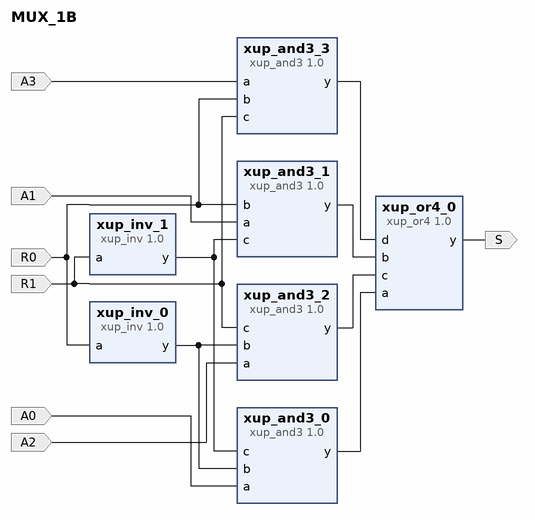
[diagram p0: block diagram of the top level]
# Vivado block design MUX_1B, xc7a100tcsg324-1, Vivado 2019.1
create_bd_design MUX_1B

create_bd_port -dir I A2
create_bd_port -dir I A3
create_bd_port -dir I R0
create_bd_port -dir I R1
create_bd_port -dir I A0
create_bd_port -dir O S
create_bd_port -dir I A1

create_bd_cell -type ip -vlnv xilinx.com:xup:xup_and3:1.0 xup_and3_0
create_bd_cell -type ip -vlnv xilinx.com:xup:xup_and3:1.0 xup_and3_1
create_bd_cell -type ip -vlnv xilinx.com:xup:xup_and3:1.0 xup_and3_2
create_bd_cell -type ip -vlnv xilinx.com:xup:xup_and3:1.0 xup_and3_3
create_bd_cell -type ip -vlnv xilinx.com:xup:xup_or4:1.0 xup_or4_0
create_bd_cell -type ip -vlnv xilinx.com:xup:xup_inv:1.0 xup_inv_0
create_bd_cell -type ip -vlnv xilinx.com:xup:xup_inv:1.0 xup_inv_1

# ---- connections ----

connect_bd_net [get_bd_pins xup_and3_0/y] [get_bd_pins xup_or4_0/a]
connect_bd_net [get_bd_pins xup_and3_1/y] [get_bd_pins xup_or4_0/b]
connect_bd_net [get_bd_pins xup_and3_2/y] [get_bd_pins xup_or4_0/c]
connect_bd_net [get_bd_pins xup_and3_3/y] [get_bd_pins xup_or4_0/d]
connect_bd_net -net DIV_1 [get_bd_ports A2] [get_bd_pins xup_and3_2/a]
connect_bd_net -net MIROIR_1 [get_bd_ports A3] [get_bd_pins xup_and3_3/a]
connect_bd_net [get_bd_pins xup_inv_0/y] [get_bd_pins xup_and3_0/b] [get_bd_pins xup_and3_2/b]
connect_bd_net -net R0_1 [get_bd_ports R0] [get_bd_pins xup_and3_1/b] [get_bd_pins xup_inv_0/a] [get_bd_pins xup_and3_3/b]
connect_bd_net [get_bd_pins xup_inv_1/y] [get_bd_pins xup_and3_1/c] [get_bd_pins xup_and3_0/c]
connect_bd_net -net R1_1 [get_bd_ports R1] [get_bd_pins xup_and3_2/c] [get_bd_pins xup_inv_1/a] [get_bd_pins xup_and3_3/c]
connect_bd_net [get_bd_pins xup_or4_0/y] [get_bd_ports S]
connect_bd_net -net A0_1 [get_bd_ports A0] [get_bd_pins xup_and3_0/a]
connect_bd_net -net A1_1 [get_bd_ports A1] [get_bd_pins xup_and3_1/a]

validate_bd_design
save_bd_design
